# Altium schematic sheet Thermocouples.SchDoc: Thermocouples
size Letter; DocumentNumber: 8; SheetNumber: 8; SheetTotal: 11
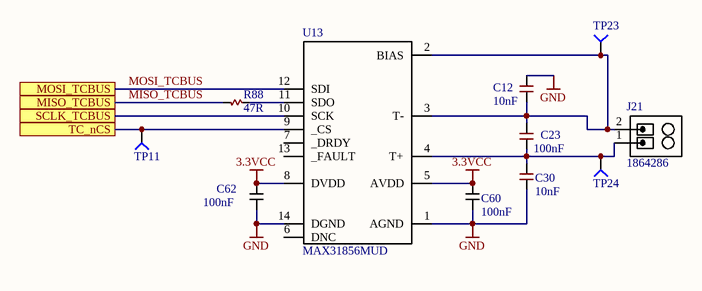
[diagram p0: Thermocouples.SchDoc]

## Parts
C12  10nF  [C0402]
C23  100nF  [C0603]
C30  10nF  [C0402]
C60  100nF  [C0201 Large Pads]
C62  100nF  [C0201 Large Pads]
J21  1864286  [1864286]
R88  47R  [R0402]
TP11  TP4  [TP-2]  (value not drawn)  (no BOM)
TP23  TP4  [TP-2]  (value not drawn)  (no BOM)
TP24  TP4  [TP-2]  (value not drawn)  (no BOM)
U13  MAX31856MUD  [TSSOP-14L 65P640X110]

## Ports
MISO_TCBUS, MOSI_TCBUS, SCLK_TCBUS, TC_nCS

## Nets
3.3VCC: C60.2 C62.2 U13.5(AVDD) U13.8(DVDD)
GND: C12.2 C30.1 C60.1 C62.1 U13.1(AGND) U13.14(DGND)
MISO_TCBUS: R88.2 ; port MISO_TCBUS
MOSI_TCBUS: U13.12(SDI) ; port MOSI_TCBUS
SCLK_TCBUS: U13.10(SCK) ; port SCLK_TCBUS
TC_nCS: TP11.1 U13.9(_CS) ; port TC_nCS
NetC12_1: C12.1 C23.2 J21.2(S) TP23.1 U13.2(BIAS) U13.3(T-)
NetC23_1: C23.1 C30.2 J21.1(S) TP24.1 U13.4(T+)
NetR88_1: R88.1 U13.11(SDO)

Not connected (* = marked no-connect by the designer): U13 6(DNC) 7(_DRDY) 13(_FAULT)

## Notes on the sheet
- Title:
- Project:
- File:
- Ver:
- Drawn by:
- Sheet:
- of

## Library data of the parts
C12 C30 = 10nF 0402 50V X7R: CAP CER 10nF 50V X7R 0402; PART DESCRIPTION: 10000pF ±5% 50V Ceramic Capacitor X7R 0402 (1005 Metric); MANUFACTURER #: GRM155R71H103JA88D; MANUFACTURER: Murata; TOLERANCE: 5%; EE_SPEC: 50V; DISTRIBUTOR #: 490-7763-1-ND; DISTRIBUTOR: Digikey; PART: GRM155R71H103JA88D; VALUE: 10nF
C23 = 100nF 0603 50V X7R: CAP CER 0603 100nF 50V 10% X7R; MANUFACTURER: Kemet; MANUFACTURER #: C0603C104K5RACTU; PART DESCRIPTION: 0.10µF ±10% 50V Ceramic Capacitor X7R 0603 (1608 Metric); DISTRIBUTOR #: 399-5089-2-ND; DISTRIBUTOR: Digikey; PART: C0603C104K5RACTU; TOLERANCE: 10%; EE_SPEC: 50V; VALUE: 100nF
C60 C62 = 100nF 6.3V X5R 0201: CAP CER 0.1UF 6.3V 10% X5R 0201; MANUFACTURER: Samsung; MANUFACTURER #: CL03A104KQ3NNNC; VALUE: 100nF; DISTRIBUTOR: DIGI-KEY; DISTRIBUTOR #: 1276-1013-1-ND; TOLERANCE: 10%; VOLTAGE: 6.3V; PART: CL03A104KQ3NNNC
J21 = 2POS 45DEG 3.5MM Push-Spring Terminal Block: TERM BLOCK 2POS 45DEG 3.5MM PCB; MANUFACTURER: Phoenix Contact; PART DESCRIPTION: 2 Positions Header Connector 0.100" (2.54mm) Through Hole, Right Angle Gold; TOLERANCE: -NA-; MANUFACTURER #: 1864286; DISTRIBUTOR #: 277-12184-ND; DISTRIBUTOR: Digikey; PART: 1864286; EE_SPEC: -NA-; VALUE: 1864286
R88 = 47R 1% 0402: RES 47 OHM 1% 1/16W 0402; MANUFACTURER: Vishay Dale; MANUFACTURER #: CRCW040247R0FKEDC; Part Description: 47 Ohms ±1% 0.063W, 1/16W Chip Resistor 0402 (1005 Metric)  Thick Film; Tolerance: +/- 1%; VALUE: 47R; EE_SPEC: 47R 1% 0402; PART: CRCW040247R0FKEDC
TP11 TP23 TP24 = Socket: MANUFACTURER #: NOTAPART-Testpoint; PART: NOTAPART-Testpoint
U13 = MAX31856: IC CONV THERMOCOUPLE 14TSSOP; MANUFACTURER: Maxim; VOLTAGE: 3.3V; PART: MAX31856MUD; MANUFACTURER #: MAX31856MUD